# Altium schematic sheet MR_UartConnector.SchDoc
size A4; CompanyName: BeeIonic; SheetNumber: 7; SheetTotal: 7
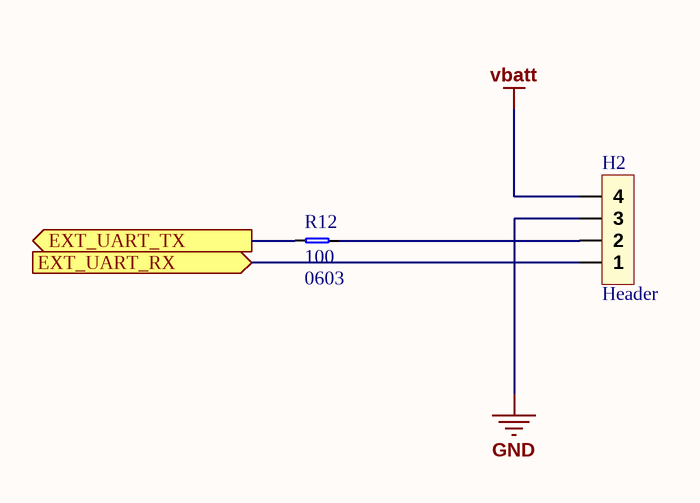
[diagram p0: MR_UartConnector.SchDoc]

## Parts
H2  Header  [HE14 1x4 Straight]
R12  value 100  Package: 0603  [0603_RES_LD]  (hidden comment: Resistor)

## Ports
EXT_UART_RX (in), EXT_UART_TX (out)

## Nets
GND: H2.3
vbatt: H2.4
EXT_UART_RX: H2.1 ; port EXT_UART_RX
EXT_UART_TX: R12.1 ; port EXT_UART_TX
NetH2_2: H2.2 R12.2

## Notes on the sheet
- Project :
- Title :
- Sheet:
- of
- Creation Date :
- Designer :
- Modified Date :

## Library data of the parts
H2 = Header_4x1: Header 4x1 PIns
R12 = Resistor: Precision: *